# EAGLE design BRAINNEO (EAGLE 8.2.2)
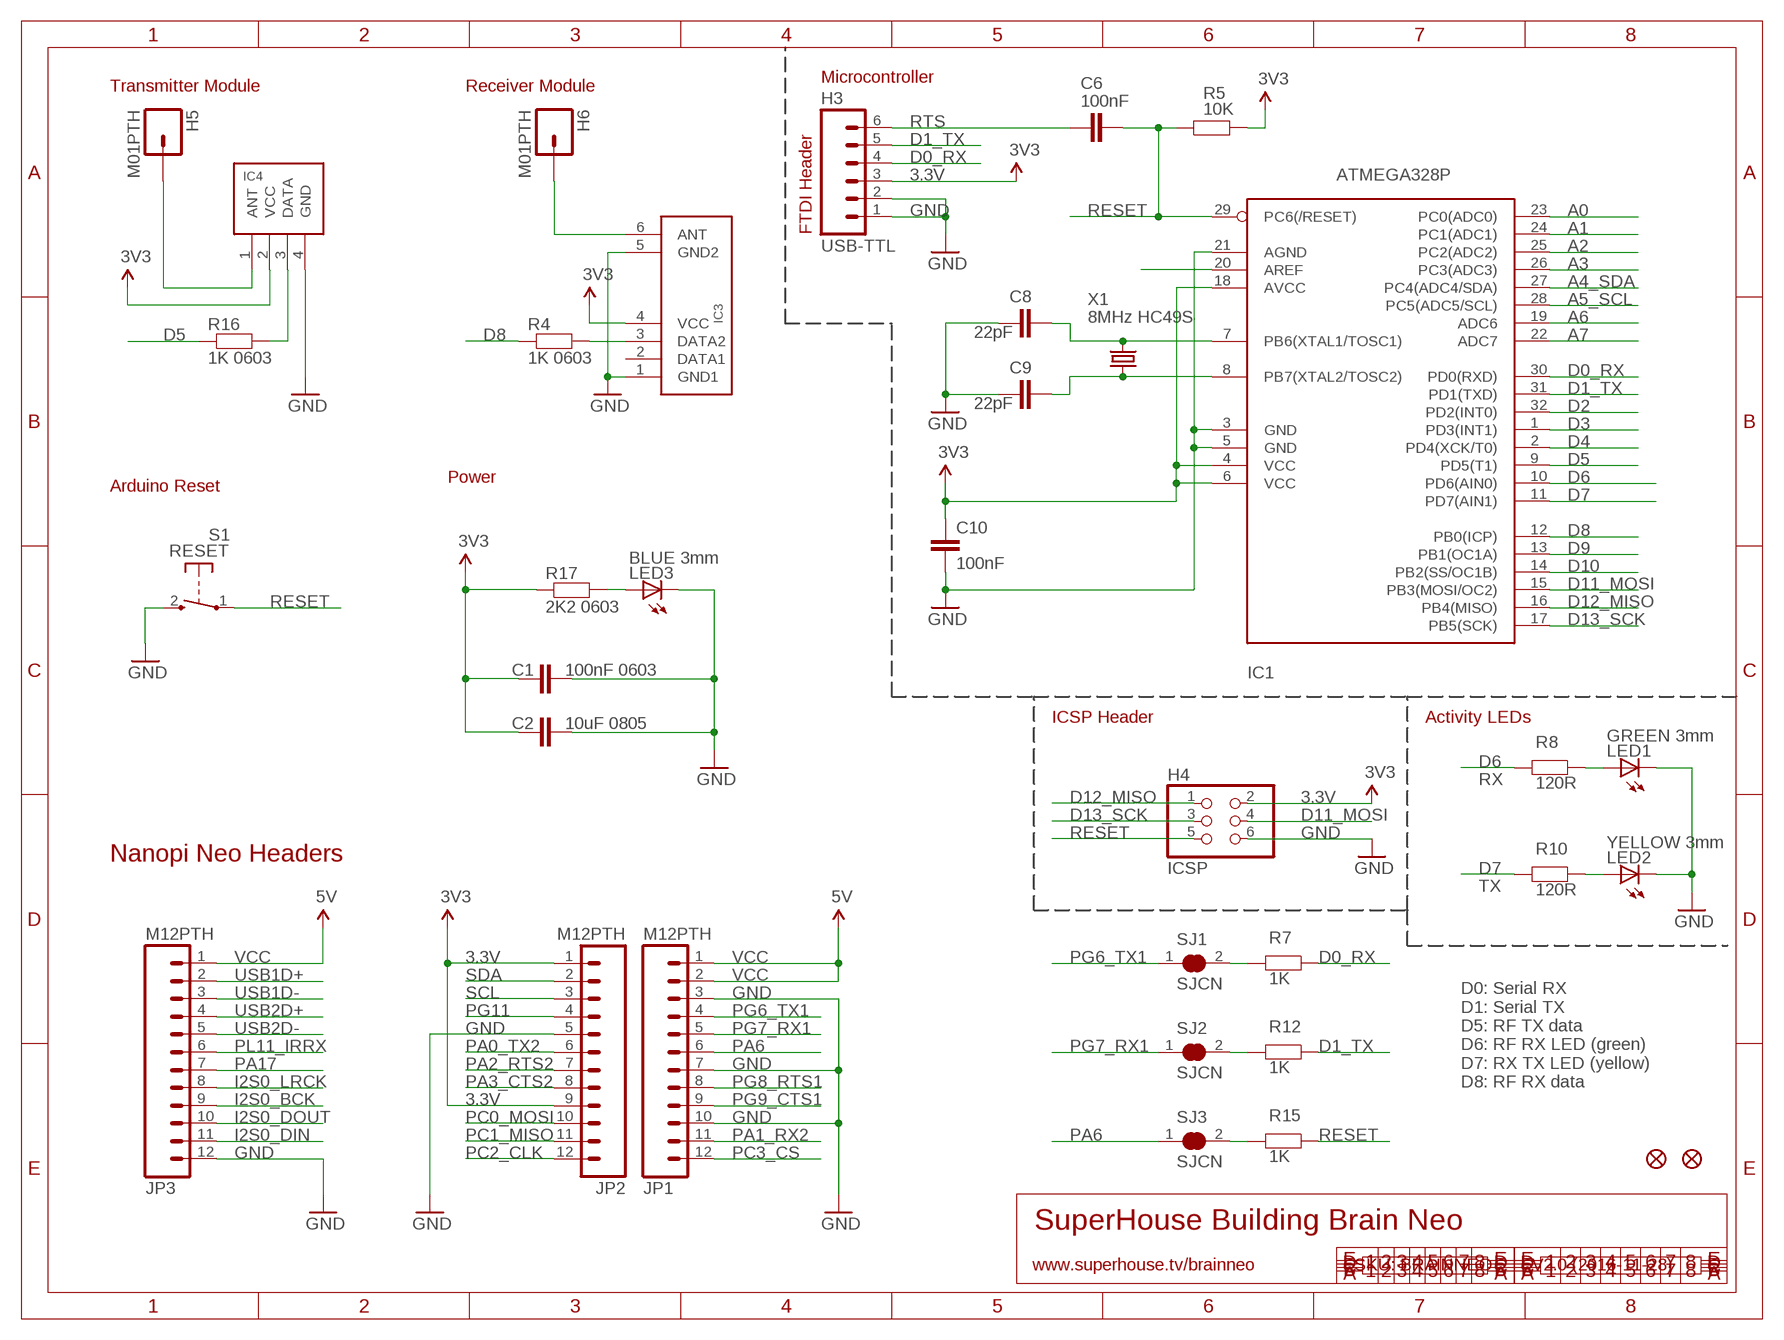
[diagram p0: schematic, sheet 1]

## Parts
C1  100nF 0603  CAP0603  [0603]
C2  10uF 0805  C-EUC0805  [C0805]
C6  100nF  CAP0603  [0603]
C8  22pF  CAP0603  [0603]
C9  22pF  CAP0603  [0603]
C10  100nF  CAP0603  [0603]
H3  USB-TTL  M06SIP  [1X06]
H4  ICSP  PINHD-2X3  [2X03]
H5  M01PTH  [1X01]
H6  M01PTH  [1X01]
IC1  ATMEGA328P  AVR-MEGA8-AI  [TQFP32-08]
IC3  RXB1  RXB1SHORTFLAT  [RX-B1-SHORT-FLAT]
IC4  TX-C1FLAT  [TX-C1-FLAT]
JP1  M12PTH  [1X12]
JP2  M12PTH  [1X12]
JP3  M12PTH  [1X12]
LED1  GREEN 3mm  LED3MM  [LED3MM]
LED2  YELLOW 3mm  LED3MM  [LED3MM]
LED3  BLUE 3mm  LED3MM  [LED3MM]
R4  1K 0603  RESISTOR0603  [0603]
R5  10K  RESISTOR0603  [0603]
R7  1K  RESISTOR0603  [0603]
R8  120R  RESISTOR0603  [0603]
R10  120R  RESISTOR0603  [0603]
R12  1K  RESISTOR0603  [0603]
R15  1K  RESISTOR0603  [0603]
R16  1K 0603  RESISTOR0603  [0603]
R17  2K2 0603  RESISTOR0603  [0603]
S1  RESET  TAC_SWITCH_2PIN  [TACTILE_SWITCH_SMD_2PIN_TINY]
SJ1  SJCN  [SJC]
SJ2  SJCN  [SJC]
SJ3  SJCN  [SJC]
U$5  FIDUCIAL1X2.5  [FIDUCIAL-1X2.5]
U$6  FIDUCIAL1X2.5  [FIDUCIAL-1X2.5]
X1  8MHz HC49S  CRYSTALHC49UV  [HC49U-V]

## Nets
3.3V: C1.1 C2.2 C10.1 H3.3 H4.2 IC1.4(VCC) IC1.6(VCC) IC1.18(AVCC) IC3.4(VCC) IC4.2(VCC) JP2.1 JP2.9 R5.2 R17.1 ; supply symbol labelled 3V3
A0: IC1.23(PC0(ADC0))
A1: IC1.24(PC1(ADC1))
A2: IC1.25(PC2(ADC2))
A3: IC1.26(PC3(ADC3))
A4_SDA: IC1.27(PC4(ADC4/SDA))
A5_SCL: IC1.28(PC5(ADC5/SCL))
A6: IC1.19(ADC6)
A7: IC1.22(ADC7)
AREF: IC1.20(AREF)
D0_RX: H3.4 IC1.30(PD0(RXD)) R7.1
D1_TX: H3.5 IC1.31(PD1(TXD)) R12.1
D2: IC1.32(PD2(INT0))
D3: IC1.1(PD3(INT1))
D4: IC1.2(PD4(XCK/T0))
D5: IC1.9(PD5(T1)) R16.1
D6: IC1.10(PD6(AIN0)) R8.2
D7: IC1.11(PD7(AIN1)) R10.2
D8: IC1.12(PB0(ICP)) R4.1
D9: IC1.13(PB1(OC1A))
D10: IC1.14(PB2(SS/OC1B))
D11_MOSI: H4.4 IC1.15(PB3(MOSI/OC2))
D12_MISO: H4.1 IC1.16(PB4(MISO))
D13_SCK: H4.3 IC1.17(PB5(SCK))
GND: C1.2 C2.1 C8.1 C9.1 C10.2 H3.1 H3.2 H4.6 IC1.3(GND) IC1.5(GND) IC1.21(AGND) IC3.1(GND1) IC3.5(GND2) IC4.4(GND) JP1.3 JP1.7 JP1.10 JP2.5 JP3.12 LED1.K(C) LED2.K(C) LED3.K(C) S1.2(S)
I2S0_BCK: JP3.9
I2S0_DIN: JP3.11
I2S0_DOUT: JP3.10
I2S0_LRCK: JP3.8
N$288: IC3.3(DATA2) R4.2
N$289: LED3.A R17.2
N$290: H6.1 IC3.6(ANT)
N$291: H5.1 IC4.1(ANT)
N$292: IC4.3(DATA) R16.2
N$293: C8.2 IC1.7(PB6(XTAL1/TOSC1)) X1.2
N$294: C9.2 IC1.8(PB7(XTAL2/TOSC2)) X1.1
N$295: LED1.A R8.1
N$296: LED2.A R10.1
N$297: R7.2 SJ1.2
N$298: R12.2 SJ2.2
N$299: R15.2 SJ3.2
PA0_TX2: JP2.6
PA1_RX2: JP1.11
PA2_RTS2: JP2.7
PA3_CTS2: JP2.8
PA6: JP1.6 SJ3.1
PA17: JP3.7
PC0_MOSI: JP2.10
PC1_MISO: JP2.11
PC2_CLK: JP2.12
PC3_CS: JP1.12
PG6_TX1: JP1.4 SJ1.1
PG7_RX1: JP1.5 SJ2.1
PG8_RTS1: JP1.8
PG9_CTS1: JP1.9
PG11: JP2.4
PL11_IRRX: JP3.6
RESET: C6.2 H4.5 IC1.29(PC6(/RESET)) R5.1 R15.1 S1.1(P)
RTS: C6.1 H3.6
SCL: JP2.3
SDA: JP2.2
USB1D+: JP3.2
USB1D-: JP3.3
USB2D+: JP3.4
USB2D-: JP3.5
VCC: JP1.1 JP1.2 JP3.1 ; supply symbol labelled 5V
Unconnected: IC3.2(DATA1)

## Notes on the sheet
- Microcontroller
- Transmitter Module | Receiver Module
- FTDI Header
- Power
- Arduino Reset
- ICSP Header | Activity LEDs
- RX
- Nanopi Neo Headers
- TX
- D0: Serial RX
  D1: Serial TX
  D5: RF TX data
  D6: RF RX LED (green)
  D7: RX TX LED (yellow)
  D8: RF RX data
- SuperHouse Building Brain Neo
- www.superhouse.tv/brainneo | SKU: BRAINNEO | V2.0 (2016-11-28)

## Library data of the parts
C1 = freetronics:CAP: Capacitor Standard 0603 ceramic capacitor, and 0.1" leaded capacitor.
C2 = freetronics-jon:C-EU: CAPACITOR, European symbol
C6 C8-C10 = freetronics-master-v1.1:CAP: Capacitor Standard 0603 ceramic capacitor, and 0.1" leaded capacitor.
H3 = freetronics:M06: Header 6 Standard 6-pin 0.1" header. Use with straight break away headers (SKU : PRT-00116), right angle break away headers (PRT-00553), swiss pins (PRT-00743), machine pins (PRT-00117), and female headers (PRT-00115). Molex polarized connector foot print use with SKU : PRT-08094 with associated crimp pins and housings. NOTES ON THE VARIANTS LOCK and LOCK_LONGPADS... This footprint was designed to help hold the alignment of a through-hole component (i.e. 6-pin header) while soldering it into place. You may notice that each hole has been shifted either up or down by 0.005 of an inch from it's more standard position (which is a perfectly straight line). This slight alteration caused the pins (the squares in the middle) to touch the edges of the holes. Because they are alternating, it causes a "brace" to hold the component in place. 0.005 has proven to be the perfect amount of "off-center" position when using our standard breakaway headers. Although looks a little odd when you look at the bare footprint, once you have a header in there, the alteration is very hard to notice. Also, if you push a header all the way into place, it is covered up entirely on the bottom side. This idea of altering the position of holes to aid alignment will be further integrated into the Sparkfun Library for other footprints. It can help hold any component with 3 or more connection pins.
H4 = pinhead:PINHD-2X3: PIN HEADER
H5 H6 = freetronics:M01: Header 1 Standard 1-pin 0.1" header. Use with straight break away headers (SKU : PRT-00116), right angle break away headers (PRT-00553), swiss pins (PRT-00743), machine pins (PRT-00117), and female headers (PRT-00115).
IC1 = freetronics-master-v1.1:AVR-MEGA8: MICROCONTROLLER 8 Kbytes FLASH 1 kbytes SRAM 512 bytes EEPROM USART 6-channel 10 bit ADC 2-channel 8 bit ADC
IC3 = freetronics-master-v1:RXB1SHORT
IC4 = freetronics-jon:TX-C1
JP1-JP3 = freetronics-original:M12: Header 12 Standard 12-pin 0.1" header. Use with straight break away headers (SKU : PRT-00116), right angle break away headers (PRT-00553), swiss pins (PRT-00743), machine pins (PRT-00117), and female headers (PRT-00115).
LED1-LED3 = freetronics-2:LED: LEDs Standard schematic elements and footprints for 5mm, 3mm, 1206, and 0603 sized LEDs. 5mm - Spark Fun Electronics SKU : COM-00529 (and others)
R4 R16 R17 = freetronics-jon:RESISTOR: Resistor Basic schematic elements and footprints for 0603, 1206, and PTH 1/10th watt (small) resistors.
R5 R7 R8 R10 R12 R15 = freetronics-master-v1.1:RESISTOR: Resistor Basic schematic elements and footprints for 0603, 1206, and PTH 1/10th watt (small) resistors.
S1 = freetronics-jon:TAC_SWITCH_2PIN: Momentary Tactile Switch - 2 pin
SJ1-SJ3 = freetronics-jon:SJC
U$5 U$6 = freetronics-original:FIDUCIAL: Fiducial Alignment Points Various fiducial points for machine vision alignment.
X1 = freetronics:CRYSTAL: Crystals Various standard crystals. Proven footprints. Spark Fun Electronics SKU : COM-00534

## Board
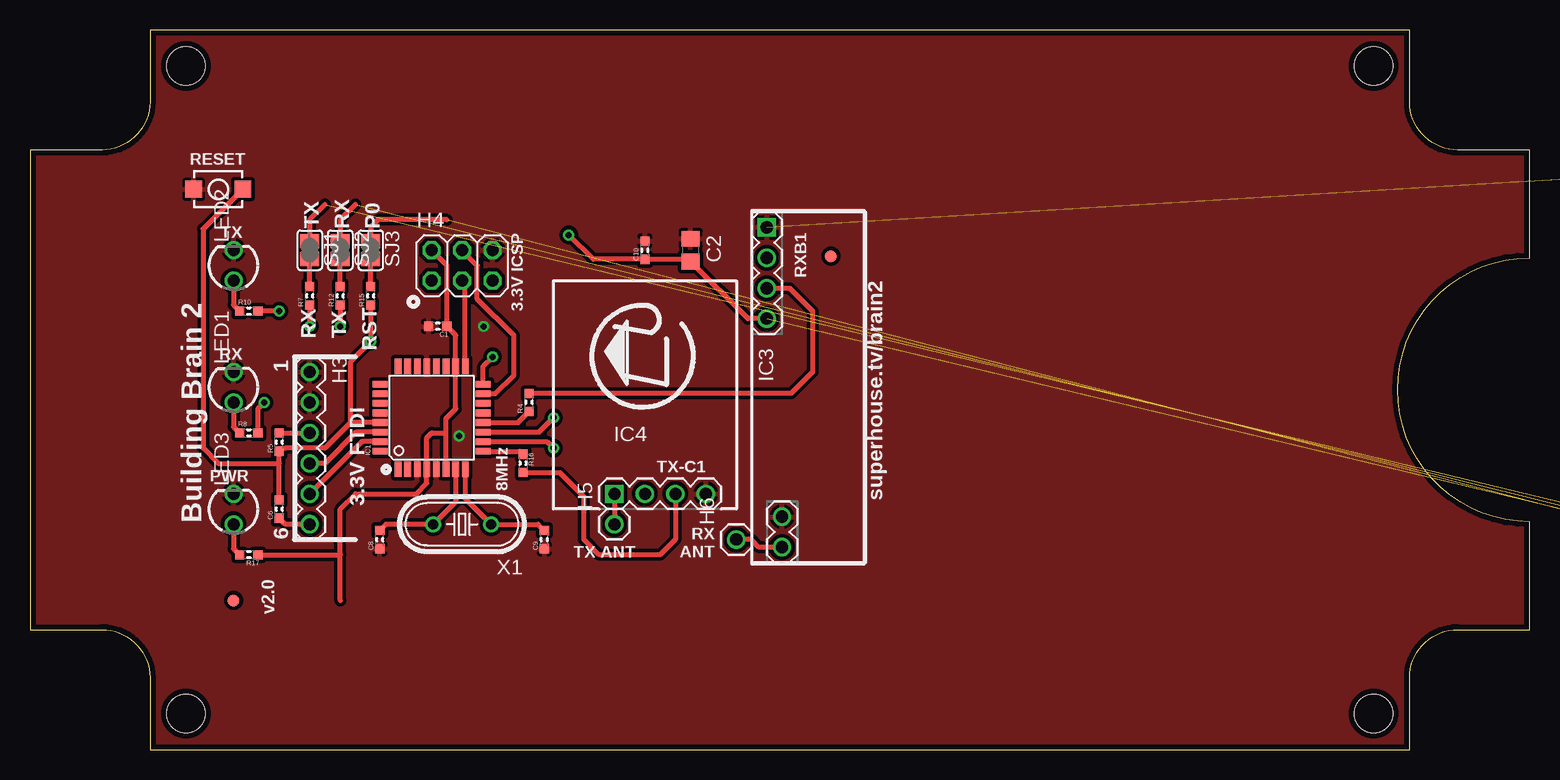
[diagram p1: board, top side]
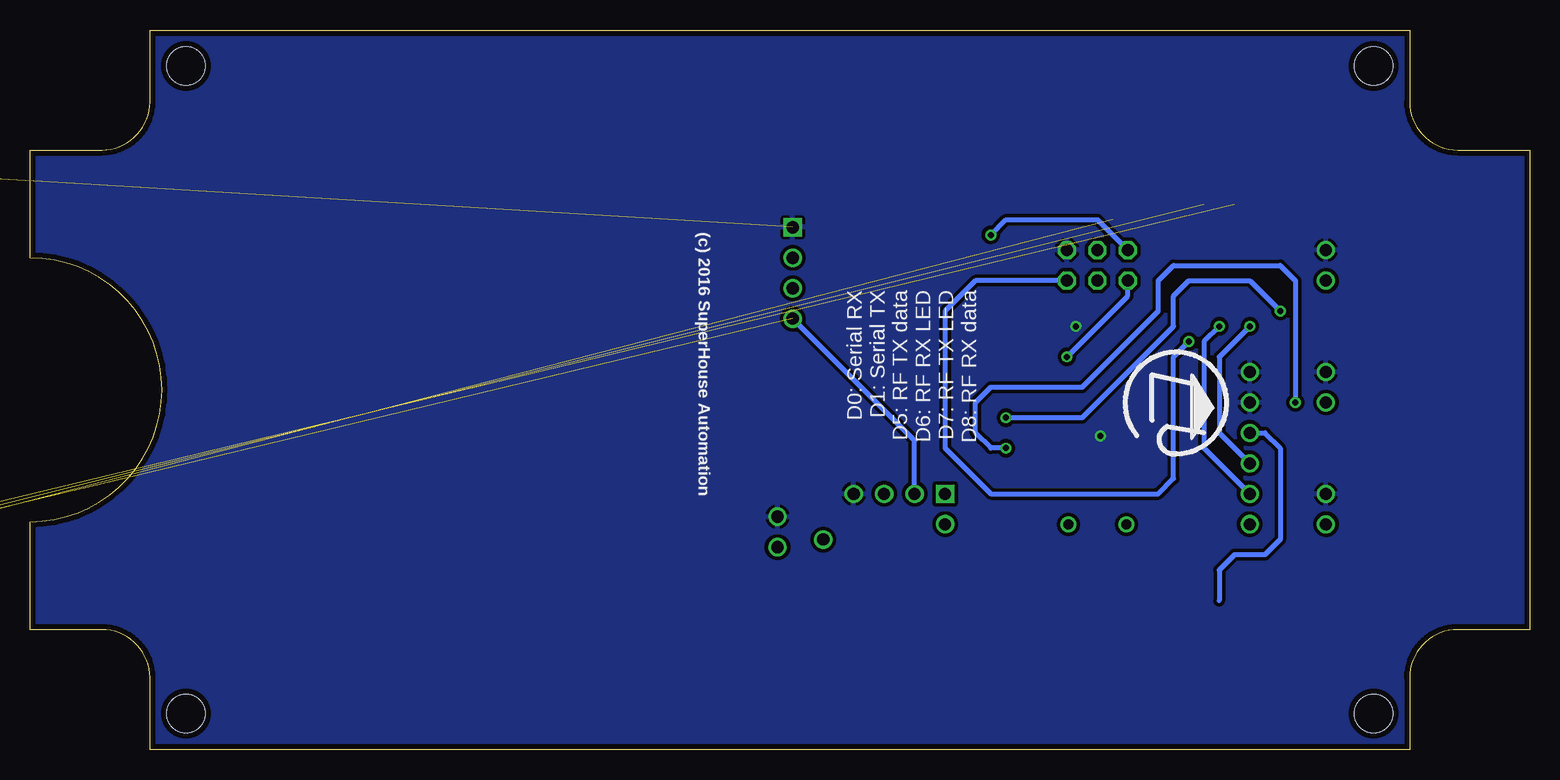
[diagram p2: board, bottom side, seen from below]

Size 125 x 60 mm. Coordinates in mm from the lower left corner, seen from the top.
Outline: 0,10 6,10 arc-90 10,6 10,0 115,0 115,6 arc-90 119,10 125,10 125,19 arc-90 114,30 arc-90 125,41 125,50 119,50 arc-90 115,54 115,60 10,60 10,54 arc-90 6,50 0,50 0,10
Copper layers (1*16): Top 0.035mm / dielectric 1.5mm / Bottom 0.035mm
Design rules "default *": minimum track width 10mil, minimum drill 24mil, track to track 12mil, track to pad 12mil, pad to pad 12mil, via to via 12mil, smd to smd 8mil, copper to edge 18mil, drill to drill 8mil, minimum pad ring 10mil, minimum via ring 8mil, stop-mask expansion 4mil, vias tented up to drill 0mil, thermal gap 10mil
Holes 3.2 mm at 13,57 13,3 112,3 112,57 177.7,47.7 142.3,47.7 142.3,12.3 177.7,12.3

### Footprints (pad centres in the part's own frame; a part is rotated, then mirrored left to right if it is on the bottom)
0603 = smd 0.762 x 0.762: 1 -0.762,0; 2 0.762,0
C0805 = smd 1.3 x 1.5: 1 -0.95,0; 2 0.95,0
1X06 = drill 1.016: 1 0,0; 2 2.54,0; 3 5.08,0; 4 7.62,0; 5 10.16,0; 6 12.7,0
2X03 = drill 1.016 octagon: 1 -2.54,-1.27; 2 -2.54,1.27; 3 0,-1.27; 4 0,1.27; 5 2.54,-1.27; 6 2.54,1.27
1X01 = drill 1.016: 1 0,0
TQFP32-08 = smd 1.27 x 0.559: 1 -4.293,2.8; 2 -4.293,2; 3 -4.293,1.2; 4 -4.293,0.4; 5 -4.293,-0.4; 6 -4.293,-1.2; 7 -4.293,-2; 8 -4.293,-2.8; 17 4.293,-2.8; 18 4.293,-2; 19 4.293,-1.2; 20 4.293,-0.4; 21 4.293,0.4; 22 4.293,1.2; 23 4.293,2; 24 4.293,2.8 | smd 0.559 x 1.27: 9 -2.8,-4.293; 10 -2,-4.293; 11 -1.2,-4.293; 12 -0.4,-4.293; 13 0.4,-4.293; 14 1.2,-4.293; 15 2,-4.293; 16 2.8,-4.293; 25 2.8,4.293; 26 2,4.293; 27 1.2,4.293; 28 0.4,4.293; 29 -0.4,4.293; 30 -1.2,4.293; 31 -2,4.293; 32 -2.8,4.293
RX-B1-SHORT-FLAT = drill 1.016 square: 1 0,0 | drill 1.016: 2 2.54,0; 3 5.08,0; 4 7.62,0; 5 24.13,1.27; 6 26.67,1.27
TX-C1-FLAT = drill 1.016 square: 1 0,0 | drill 1.016: 2 2.54,0; 3 5.08,0; 4 7.62,0
1X12 = drill 1.016: 1 0,0; 2 2.54,0; 3 5.08,0; 4 7.62,0; 5 10.16,0; 6 12.7,0; 7 15.24,0; 8 17.78,0; 9 20.32,0; 10 22.86,0; 11 25.4,0; 12 27.94,0
LED3MM = drill 1: A -1.27,0; K 1.27,0
TACTILE_SWITCH_SMD_2PIN_TINY = smd 1.4 x 1.4: 1 -2.05,0; 2 2.05,0
SJC = smd 1.168 x 1.6: 1 -0.762,0; 2 0.762,0
FIDUCIAL-1X2.5 = smd 1 x 1: 1 0,0
HC49U-V = drill 0.813: 1 -2.413,0; 2 2.413,0

### Placement (x,y rotation side)
C1  33.99,35.29 180 top
C2  55.07,41.64 270 top
C6  20.78,20.05 90 top
C8  29.16,17.51 90 top
C9  42.88,17.51 90 top
C10  51.26,41.64 90 top
H3  23.32,31.48 270 top
H4  36.02,40.37 0 top
H5  48.72,18.78 90 top
H6  58.88,17.51 90 top
IC1  33.48,27.67 90 top
IC3  61.42,43.55 270 top
IC4  48.72,21.32 0 top
JP1  174,11.3 180 top  (outside the outline)
JP2  174,13.84 180 top  (outside the outline)
JP3  174,48.7 180 top  (outside the outline)
LED1  16.97,30.21 90 top
LED2  16.97,40.37 90 top
LED3  16.97,20.05 90 top
R4  41.61,28.94 90 top
R5  20.78,25.64 90 top
R7  23.32,37.83 90 top
R8  18.24,26.4 0 top
R10  18.24,36.56 0 top
R12  25.86,37.83 90 top
R15  28.4,37.83 90 top
R16  41.1,23.86 270 top
R17  18.24,16.24 180 top
S1  15.7,46.72 180 top
SJ1  23.32,41.64 270 top
SJ2  25.86,41.64 270 top
SJ3  28.4,41.64 270 top
U$5  66.75,41.13 90 top
U$6  16.97,12.43 90 top
X1  36.02,18.78 180 top

### Tracks (layer width: path | path; a pad name or v marks a point on that pad's centre or on a via)
3.3V  (via drill 0.5)  (3 unrouted)
  Top 0.406: IC3.4 59.84,35.92 C2.2 54.88,40.88 C10.1 46.94,40.88 v44.91,42.91 | IC1.6 34.68,26.4 | 34.68,26.4 34.68,27.6 35.48,28.4 IC1.18 35.48,34.56 C1.1 34.75,40.37 H4.2 | 34.68,26.4 33.48,26.4 33.08,26 IC1.4 33.08,22.19 32.21,21.32 27.13,21.32 25.86,20.05 25.86,16.24 | R17.1 25.86,16.24 | R5.2 H3.3 | 25.86,12.43 25.86,16.24
  Bottom 0.406: v44.91,42.91 43.64,44.18 36.02,44.18 H4.2 | H3.3 22.05,26.4 20.78,25.13 20.78,17.51 22.05,16.24 24.59,16.24 25.86,14.97 25.86,12.43 | IC4.2 51.26,25.77 IC3.4
D0_RX  (via drill 0.5)
  Top 0.406: IC1.30 27.2,26.47 24.59,23.86 H3.4 | R7.1 v23.32,35.29
  Bottom 0.406: v23.32,35.29 25.86,32.75 25.86,26.4 H3.4
D1_TX  (via drill 0.5)
  Top 0.406: IC1.31 27.67,25.67 H3.5 | R12.1 v25.86,35.29
  Bottom 0.406: 25.86,23.86 H3.5 27.13,25.13 27.13,34.02 v25.86,35.29
D5
  Top 0.406: IC1.9 40.85,24.87 R16.1
D6  (via drill 0.5)
  Top 0.406: IC1.10 43.1,25.67 v43.64,25.13 | R8.2 19,28.43 v19.51,28.94
  Bottom 0.406: v43.64,25.13 44.91,25.13 46.18,26.4 46.18,28.94 44.91,30.21 37.29,30.21 30.94,36.56 30.94,39.1 29.67,40.37 20.78,40.37 19.51,39.1 v19.51,28.94
D7  (via drill 0.5)
  Top 0.406: IC1.11 42.44,26.47 v43.64,27.67 | v20.78,36.56 R10.2
  Bottom 0.406: v43.64,27.67 37.29,27.67 29.67,35.29 29.67,37.83 28.4,39.1 23.32,39.1 v20.78,36.56
D8
  Top 0.406: IC1.12 40.7,27.27 R4.1
D11_MOSI
  Top 0.406: IC1.15 38.78,29.67 40.34,31.23 40.34,34.53 37.29,37.58 37.29,40.37 H4.4
D12_MISO  (via drill 0.5)
  Top 0.406: IC1.16 37.77,31.96 v38.56,32.75
  Bottom 0.406: v38.56,32.75 33.48,37.83 H4.1
D13_SCK
  Top 0.406: IC1.17 36.28,38.84 H4.3
GND  (via drill 0.5)  (5 unrouted)
  other vias: 35.77,26.15 37.8,35.29
  pour Top: 0,10 0,50 6,50 arc90 10,54 10,60 115,60 115,54 arc90 119,50 125,50 125,41 arc90 114,30 arc90 125,19 125,10 119,10 arc90 115,6 115,0 10,0 10,6 arc90 6,10
  pour Bottom: 0,10 0,50 6,50 arc90 10,54 10,60 115,60 115,54 arc90 119,50 125,50 125,41 arc90 114,30 arc90 125,19 125,10 119,10 arc90 115,6 115,0 10,0 10,6 arc90 6,10
N$288
  Top 0.406: IC3.3 63.33,38.47 65.23,36.56 65.23,31.48 63.45,29.7 R4.2
N$289
  Top 0.406: LED3.A 16.97,16.75 R17.2
N$290
  Top 0.406: IC3.6 60.78,16.88 60.15,17.51 H6.1
N$291
  Top 0.406: IC4.1 H5.1
N$292
  Top 0.406: R16.2 44.15,23.1 46.18,21.07 46.18,17.51 47.45,16.24 52.53,16.24 53.8,17.51 IC4.3
N$293
  Top 0.406: IC1.7 35.48,20.65 X1.2 29.67,18.78 C8.2
N$294
  Top 0.406: IC1.8 36.28,20.93 X1.1 42.37,18.78 C9.2
N$295
  Top 0.406: LED1.A 16.97,26.91 R8.1
N$296
  Top 0.406: LED2.A 16.97,37.07 R10.1
N$297
  Top 0.406: R7.2 SJ1.2
N$298
  Top 0.406: R12.2 SJ2.2
N$299
  Top 0.406: R15.2 SJ3.2
PA6  (1 unrouted)
  Top 0.406: 34.75,44.18 29.04,44.18 28.4,43.55 SJ3.1
PG6_TX1  (1 unrouted)
  Top 0.406: 24.59,45.45 23.32,44.18 SJ1.1
PG7_RX1  (1 unrouted)
  Top 0.406: 27.13,45.45 25.86,44.18 SJ2.1
RESET  (via drill 0.5)
  Top 0.406: C6.2 20.78,23.86 | 20.78,23.86 R5.1 21.29,25.13 24.59,25.13 26.73,27.27 | IC1.29 26.73,27.27 | R15.1 v28.4,34.02 26.73,32.35 26.73,27.27 | S1.1 14.43,43.4 14.43,25.13 15.7,23.86 20.78,23.86
  Bottom 0.406: H4.5 46.18,39.1 48.72,36.56 48.72,25.13 44.91,21.32 30.94,21.32 29.67,22.59 29.67,32.75 v28.4,34.02
RTS
  Top 0.406: H3.6 21.29,18.78 C6.1
VCC  (2 unrouted)

### Text on the board
tPlace: RESET | TX | TX | RX | P0 | RXB1 | 3.3V ICSP | RX | RX | TX | RST | 1 | superhouse.tv/brain2 | TX-C1 | PWR | 8MHz | 3.3V FTDI | Building Brain 2 | RX / ANT | 6 | TX ANT | v2.0
bPlace: (c) 2016 SuperHouse Automation | D0: Serial RX / D1: Serial TX / D5: RF TX data / D6: RF RX LED / D7: RF TX LED / D8: RF RX data